# EAGLE design Buck_3V3_D20V10F3 (EAGLE 9.4.2)
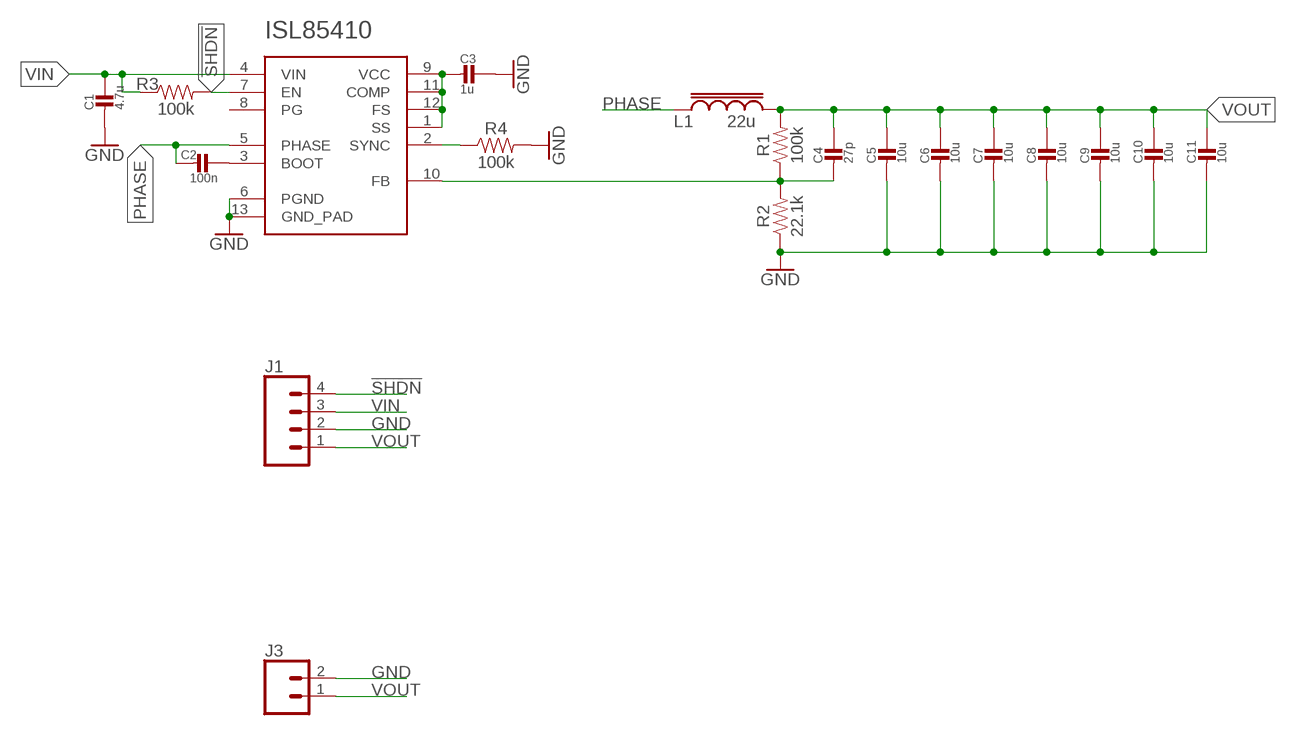
[diagram p0: schematic, sheet 1]

## Parts
C1  4.7u  CAP_CERAMIC_0603  [0603]
C2  100n  CAP_CERAMIC_0603  [0603]
C3  1u  CAP_CERAMIC_0603  [0603]
C4  27p  CAP_CERAMIC_0603  [0603]
C5  10u  CAP_CERAMIC_0805  [0805]
C6  10u  CAP_CERAMIC_0805  [0805]
C7  10u  CAP_CERAMIC_0805  [0805]
C8  10u  CAP_CERAMIC_0805  [0805]
C9  10u  CAP_CERAMIC_0805  [0805]
C10  10u  CAP_CERAMIC_0805  [0805]
C11  10u  CAP_CERAMIC_0805  [0805]
ISL85410  BUCK_ISL85410  [DFN-12_DE-L]
J1  CONN_041X04_NO_SILK  [1X04_NO_SILK]
J3  CONN_021X02_NO_SILK  [1X02_NO_SILK]
L1  22u  INDUCTOR-CD54  [CD54]
R1  100k  RESISTOR0603  [0603]
R2  22.1k  RESISTOR0603  [0603]
R3  100k  RESISTOR0603  [0603]
R4  100k  RESISTOR0603  [0603]

## Nets
!SHDN: ISL85410.7(EN) J1.4 R3.2
BOOT: C2.1 ISL85410.3(BOOT)
FB: C4.2 ISL85410.10(FB) R1.1 R2.2
GND: C1.2 C3.1 C5.2 C6.2 C7.2 C8.2 C9.2 C10.2 C11.2 ISL85410.6(PGND) ISL85410.13(GND_PAD) J1.2 J3.2 R2.1 R4.2 ; supply symbol labelled SUPPLY_GND
PHASE: C2.2 ISL85410.5(PHASE) L1.P$1
SYNC: ISL85410.2(SYNC) R4.1
VCC: C3.2 ISL85410.1(SS) ISL85410.9(VCC) ISL85410.11(COMP) ISL85410.12(FS)
VIN: C1.1 ISL85410.4(VIN) J1.3 R3.1
VOUT: C4.1 C5.1 C6.1 C7.1 C8.1 C9.1 C10.1 C11.1 J1.1 J3.1 L1.P$2 R1.2
Unconnected: ISL85410.8(PG)

## Library data of the parts
C1-C11 = Scott-Electrical:CAP_CERAMIC
ISL85410 = Scott-ICs:BUCK_ISL85410
J1 = SparkFun-Connectors:CONN_04: Multi connection point. Often used as Generic Header-pin footprint for 0.1 inch spaced/style header connections On any of the 0.1 inch spaced packages, you can populate with these: Break Away Headers - Straight <https://www.sparkfun.com/products/116> (PRT-00116) Break Away Male Headers - Right Angle <https://www.sparkfun.com/products/553> (PRT-00553) Female Headers <https://www.sparkfun.com/products/115> (PRT-00115) Break Away Headers - Machine Pin <https://www.sparkfun.com/products/117> (PRT-00117) Break Away Female Headers - Swiss Machine Pin <https://www.sparkfun.com/products/743> (PRT-00743) For SCREWTERMINALS and SPRING TERMINALS visit here: Screw Terimnals on SparkFun.com <https://www.sparkfun.com/search/results?term=Screw+Terminals> (5mm/3.5mm/2.54mm spacing) This device is also useful as a general connection point to wire up your design to another part of your project. Our various solder wires solder well into these plated through hole pads. Hook-Up Wire - Assortment (Stranded, 22 AWG) <https://www.sparkfun.com/products/11375> (PRT-11375) Hook-Up Wire - Assortment (Solid Core, 22 AWG) <https://www.sparkfun.com/products/11367> (PRT-11367) View the entire wire category on our website here <https://www.sparkfun.com/categories/141> Special notes: Molex polarized connector foot print use with SKU : PRT-08231 with associated crimp pins and housings. 1MM SMD Version SKU: PRT-10208; PROD_ID: CONN-09696
J3 = SparkFun-Connectors:CONN_02: Multi connection point. Often used as Generic Header-pin footprint for 0.1 inch spaced/style header connections On any of the 0.1 inch spaced packages, you can populate with these: Break Away Headers - Straight <https://www.sparkfun.com/products/116> (PRT-00116) Break Away Male Headers - Right Angle <https://www.sparkfun.com/products/553> (PRT-00553) Female Headers <https://www.sparkfun.com/products/115> (PRT-00115) Break Away Headers - Machine Pin <https://www.sparkfun.com/products/117> (PRT-00117) Break Away Female Headers - Swiss Machine Pin <https://www.sparkfun.com/products/743> (PRT-00743) For SCREWTERMINALS and SPRING TERMINALS visit here: Screw Terimnals on SparkFun.com <https://www.sparkfun.com/search/results?term=Screw+Terminals> (5mm/3.5mm/2.54mm spacing) This device is also useful as a general connection point to wire up your design to another part of your project. Our various solder wires solder well into these plated through hole pads. Hook-Up Wire - Assortment (Stranded, 22 AWG) <https://www.sparkfun.com/products/11375> (PRT-11375) Hook-Up Wire - Assortment (Solid Core, 22 AWG) <https://www.sparkfun.com/products/11367> (PRT-11367) View the entire wire category on our website here <https://www.sparkfun.com/categories/141> Special notes: Molex polarized connector foot print use with: PRT-08233 with associated crimp pins and housings. 2.54_SCREWTERM for use with PRT-10571. 3.5mm Screw Terminal footprints for PRT-08084 5mm Screw Terminal footprints for use with PRT-08432
L1 = Scott-Electrical:INDUCTOR
R1-R4 = Scott-Electrical:RESISTOR: Generic Resistor Package

## Board
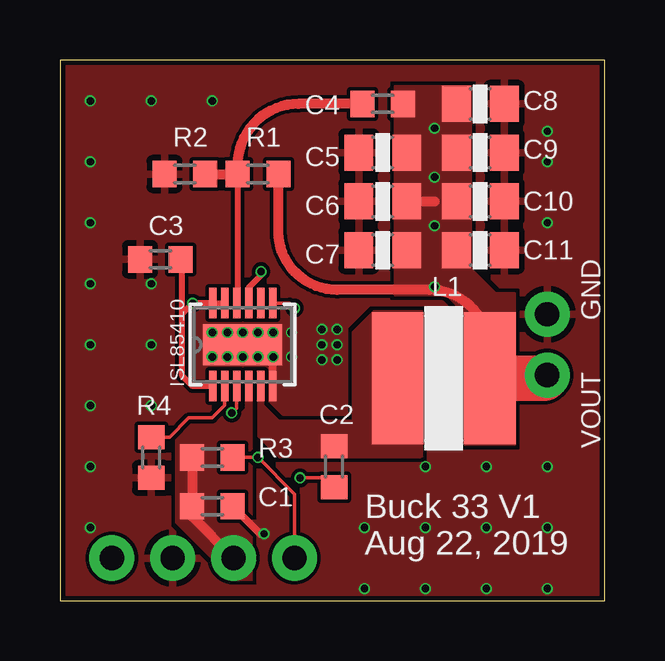
[diagram p1: board, top side]
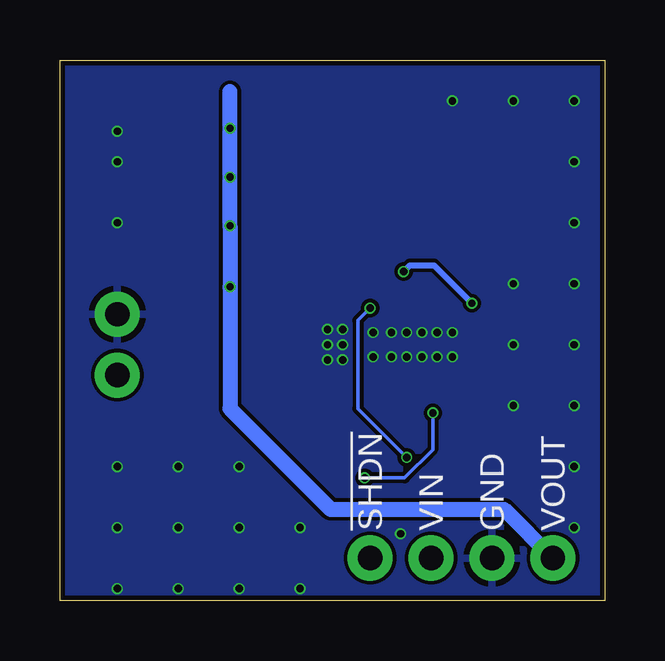
[diagram p2: board, bottom side, seen from below]

Size 22.71 x 22.53 mm. Coordinates in mm from the lower left corner, seen from the top.
Outline: 0,0 22.71,0 22.71,22.53 0,22.53 0,0
Copper layers (1*16): Top 0.035559375mm / dielectric 1.6mm / Bottom 0.035559375mm
Design rules "jlcpcb2layer": minimum track width 5mil, minimum drill 12mil, track to track 5mil, track to pad 5mil, pad to pad 5mil, via to via 5mil, smd to smd 5mil, copper to edge 8mil, drill to drill 6mil, minimum pad ring 5mil, minimum via ring 3mil, stop-mask expansion 2.5mil, vias tented up to drill 20mil, thermal gap 10mil

### Footprints (pad centres in the part's own frame; a part is rotated, then mirrored left to right if it is on the bottom)
0603 = smd 1 x 1.1: 1 -0.85,0; 2 0.85,0
0805 = smd 1.2 x 1.5: 1 -1,0; 2 1,0
DFN-12_DE-L = smd 1.27 x 0.305: 1 -1.727,1.25; 2 -1.727,0.75; 3 -1.727,0.25; 4 -1.727,-0.25; 5 -1.727,-0.75; 6 -1.727,-1.25; 7 1.727,-1.25; 8 1.727,-0.75; 9 1.727,-0.25; 10 1.727,0.25; 11 1.727,0.75; 12 1.727,1.25 | smd 1.7 x 3.3: 13 0,0
1X04_NO_SILK = drill 1.016 pad 1.88: 1 0,0; 2 2.54,0; 3 5.08,0; 4 7.62,0
1X02_NO_SILK = drill 1.016 pad 1.88: 1 0,0; 2 2.54,0
CD54 = smd 5.5 x 2.15: P$1 0,-1.925; P$2 0,1.925

### Placement (x,y rotation side)
C1  6.35,3.94 0 top
C2  11.43,5.59 90 top
C3  4.19,14.22 0 top
C4  13.46,20.7 180 top
C5  13.46,18.67 180 top
C6  13.46,16.64 180 top
C7  13.46,14.61 180 top
C8  17.53,20.7 0 top
C9  17.53,18.67 0 top
C10  17.53,16.64 0 top
C11  17.53,14.61 0 top
ISL85410  7.62,10.67 90 top
J1  2.16,1.78 0 top
J3  20.32,9.4 90 top
L1  16,9.27 270 top
R1  8.26,17.78 0 top
R2  5.21,17.78 0 top
R3  6.35,5.97 0 top
R4  3.81,5.97 270 top

### Tracks (layer width: path | path; a pad name or v marks a point on that pad's centre or on a via)
!SHDN  (via drill 0.3)
  Top 0.152: ISL85410.7 9.58,12.39 v9.78,12.19 | R3.2 v8.26,5.97 9.78,4.45 J1.4
  Bottom 0.152: v9.78,12.19 10.29,11.68 10.29,8 v8.26,5.97
BOOT  (via drill 0.3)
  Top 0.152: ISL85410.3 7.37,8.03 v7.16,7.82 | C2.1 11.05,5.12 v10.01,5.12
  Bottom 0.152: v7.16,7.82 7.16,6.3 8.34,5.12 v10.01,5.12
FB
  Top 0.254: R1.1 7.41,12.43 arc-90 ISL85410.10
  Top 0.406: C4.2 9.95,20.7 arc90 7.41,18.16 R1.1 R2.2
GND  (via drill 0.3)
  Top 0.305: ISL85410.6 8.87,10.18 8.64,10.41 | C1.2 8.34,2.79 v8.51,2.79
  other vias: 10.92,10.03 10.92,10.67 10.92,11.3 11.56,11.3 11.56,10.67 11.56,10.03 6.35,11.18 6.35,10.16 6.99,10.16 6.99,11.18 7.62,11.18 7.62,10.16 8.26,10.16 8.26,11.18 8.89,11.18 8.89,10.16 9.65,10.16 9.65,11.18 12.7,0.51 15.24,0.51 17.78,0.51 20.32,0.51 20.32,3.05 17.78,3.05 15.24,3.05 12.7,3.05 15.24,5.59 17.78,5.59 20.32,5.59 20.32,15.75 20.32,18.29 20.32,19.56 1.27,20.83 3.81,20.83 6.35,20.83 1.27,18.29 1.27,15.75 1.27,13.21 1.27,10.67 1.27,8.13 1.27,5.59 1.27,3.05 3.81,10.67 3.81,13.21 3.81,8.13
  pour Bottom (isolate 0.152, rank 6): 0.25,22.35 0.25,-0.51 22.61,-0.51 22.61,22.35
  pour Top (isolate 0.152, rank 6): 0.13,22.35 0.13,-0.64 22.73,-0.64 22.73,22.35
  pour Top (isolate 0.152, rank 5, no thermals): 4.7,13.21 12.32,13.21 12.32,7.87 4.7,7.87
PHASE
  pour Top (isolate 0.152, no thermals): 8.26,9.14 8.26,6.86 9.14,5.97 15.11,5.97 15.11,12.06 13.08,12.06 12.19,11.18 12.19,7.49 9.14,7.49 8.48,8.15 8.48,9.14
SYNC
  Top 0.152: R4.1 4.57,6.82 5.37,7.62 6.35,7.62 6.87,8.14 ISL85410.2
VCC  (via drill 0.3)
  Top 0.254: ISL85410.11 ISL85410.12 v5.54,12.39 5.08,11.94 | ISL85410.1 5.54,8.94 5.08,9.4 5.08,11.94 | ISL85410.9 7.87,13.04 8.38,13.55 v8.38,13.72 | C3.2 5.08,14.18 5.08,11.94
  Bottom 0.254: v8.38,13.72 8.13,13.97 7.11,13.97 v5.54,12.39
VIN
  Top 0.406: J1.3 5.5,3.52 C1.1 R3.1 5.53,5.97
  pour Top (isolate 0.152, no thermals): 8.01,9.27 8.01,0.83 7.24,0.83 4.83,3.25 4.83,7.69 7.4,7.69 7.73,8.01 7.73,9.27
VOUT  (via drill 0.3)
  Top 0.406: L1.P$2 17.93,10.41 arc90 15.39,12.95 11.56,12.95 arc-90 9.11,15.41 R1.2 | C6.1 15.62,16.64
  Top 1.905: J3.1 20.19,9.27 18.54,9.27
  Bottom 0.635: J1.1 4.19,3.81 11.43,3.81 15.62,8 v15.62,13.08 v15.62,15.62 v15.62,17.65 v15.62,19.68 15.62,21.21
  pour Top (isolate 0.152, no thermals): 16.89,6.48 16.89,11.94 16.13,12.7 13.97,12.7 13.97,21.46 17.14,21.46 17.14,13.84 18.16,12.83 18.96,12.83 18.96,6.48

### Text on the board
tPlace: GND | VOUT | Buck 33 V1 / Aug 22, 2019
bPlace: VOUT | GND | VIN | !SHDN